# Altium schematic sheet Power Section.SchDoc
size A; DocumentNumber: 2; SheetNumber: 26; SheetTotal: 30
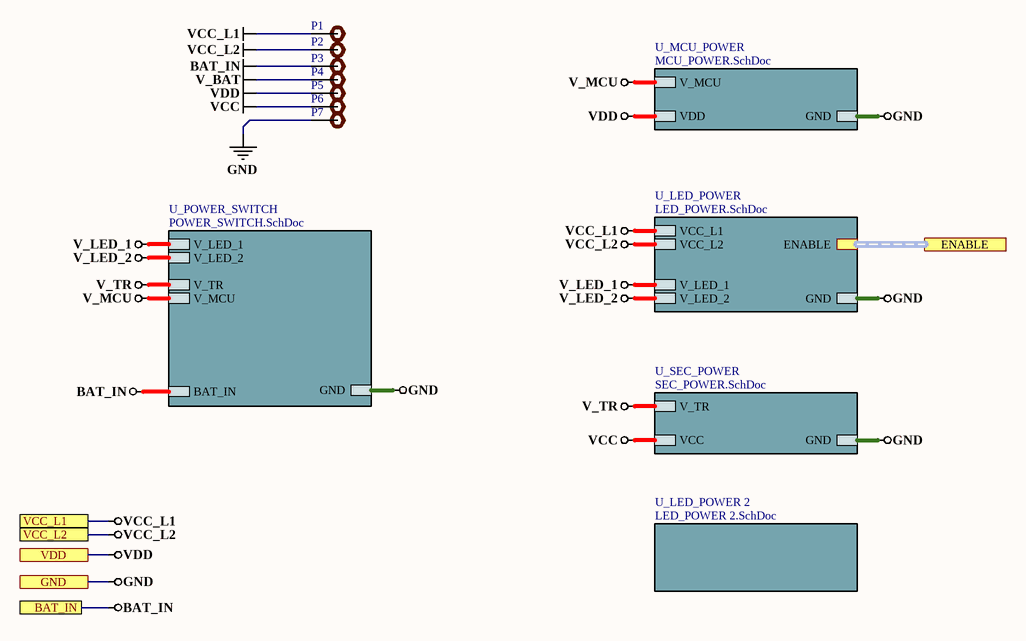
[diagram p0: Power Section.SchDoc]

## Parts
P1  Test Point  [TEST POINT]  (value not drawn)
P2  Test Point  [TEST POINT]  (value not drawn)
P3  Test Point  [TEST POINT]  (value not drawn)
P4  Test Point  [TEST POINT]  (value not drawn)
P5  Test Point  [TEST POINT]  (value not drawn)
P6  Test Point  [TEST POINT]  (value not drawn)
P7  Test Point  [TEST POINT]  (value not drawn)

## Sub-sheets
U_LED_POWER = LED_POWER.SchDoc: VCC_L2, VCC_L1, GND, V_LED_2, V_LED_1, ENABLE (harness Harness_2)
U_LED_POWER 2 = LED_POWER 2.SchDoc: no entries
U_MCU_POWER = MCU_POWER.SchDoc: VDD, V_MCU, GND
U_POWER_SWITCH = POWER_SWITCH.SchDoc: V_LED_1, V_LED_2, GND, V_TR, V_MCU, BAT_IN
U_SEC_POWER = SEC_POWER.SchDoc: VCC, V_TR, GND

## Ports
BAT_IN, ENABLE (harness Harness_2), GND, VCC_L1, VCC_L2, VDD

## Nets
BAT_IN: P3.1 ; port BAT_IN, sheet U_POWER_SWITCH/BAT_IN
GND: P7.1 ; port GND, sheet U_MCU_POWER/GND, sheet U_LED_POWER/GND, sheet U_POWER_SWITCH/GND, sheet U_SEC_POWER/GND
V_BAT: P4.1
V_LED_1: sheet U_LED_POWER/V_LED_1, sheet U_POWER_SWITCH/V_LED_1
V_LED_2: sheet U_LED_POWER/V_LED_2, sheet U_POWER_SWITCH/V_LED_2
V_MCU: sheet U_MCU_POWER/V_MCU, sheet U_POWER_SWITCH/V_MCU
V_TR: sheet U_POWER_SWITCH/V_TR, sheet U_SEC_POWER/V_TR
VCC: P6.1 ; sheet U_SEC_POWER/VCC
VCC_L1: P1.1 ; port VCC_L1, sheet U_LED_POWER/VCC_L1
VCC_L2: P2.1 ; port VCC_L2, sheet U_LED_POWER/VCC_L2
VDD: P5.1 ; port VDD, sheet U_MCU_POWER/VDD

## Buses and harness runs
harness port ENABLE = sheet U_LED_POWER/ENABLE

## Library data of the parts
P1-P7 = TEST POINT: Test Point ON